# EAGLE design YOTSUBA_GNSSantenna_ver.1.0 (EAGLE 9.6.2)
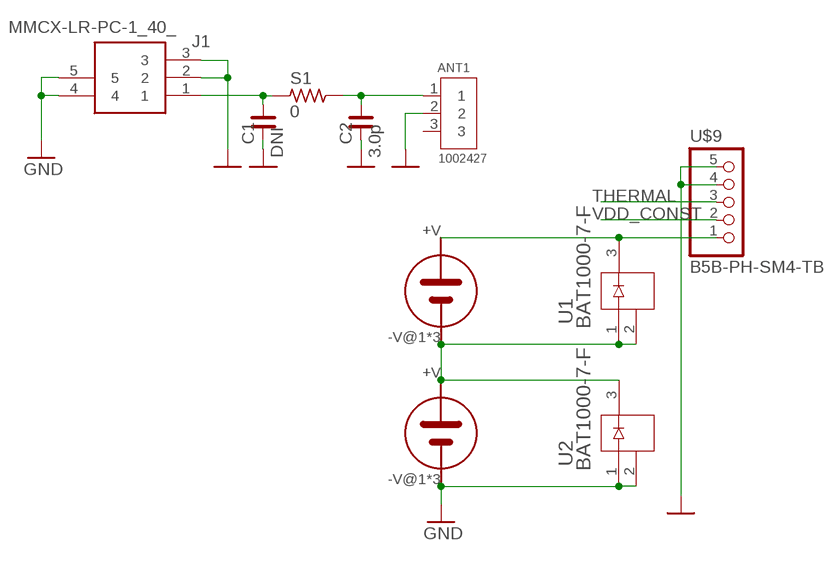
[diagram p0: schematic, sheet 1]

## Parts
ANT1  1002427  [ANTENNA_1002427]
C1  DNI  C_0603  [C0603]
C2  3.0p  C_0603  [C0603]
J1  MMCX-LR-PC-1_40_  [MMCXLRPC140]
S1  0  R_0603  [R0603]
U1  BAT1000-7-F  [SOT23_BAT_DIO]
U2  BAT1000-7-F  [SOT23_BAT_DIO]
U$2  3G30A  [SOLAR_3G30A]
U$3  3G30A  [SOLAR_3G30A]
U$9  B5B-PH-SM4-TB  [B5B-PH-SM4-TB]

## Nets
GND [GND]: ANT1.2 C1.1 C2.1 J1.2 J1.3 J1.4 J1.5 U2.1 U2.2 U$3.-V@1(-V) U$3.-V@2(-V) U$3.-V@3(-V) U$9.4 U$9.5
N$5: U1.1 U1.2 U2.3 U$2.-V@1(-V) U$2.-V@2(-V) U$2.-V@3(-V) U$3.+V
N$6: U1.3 U$2.+V U$9.1
RF1 [ANTENNA]: ANT1.1 C2.2 S1.2
RF2 [ANTENNA]: C1.2 J1.1 S1.1
THERMAL: U$9.3
VDD_CONST: U$9.2
Unconnected: ANT1.3

## Library data of the parts
ANT1 = 1002427:1002427: RF ANT 868MHZ/915MHZ STAMPED MET; DESCRIPTION: 868MHz, 915MHz, 1.575GHz Beidou, GLONASS, GPS, ISM, LoRa, LPWAN, Sigfox Stamped Metal RF Antenna 868MHz, 915MHz, 1.561GHz ~ 1.602GHz 3dBi Solder Surface Mount; DIGI-KEY_PART_NUMBER: 478-1002427TR-ND; MF: Ethertronics/AVX; MP: 1002427; PACKAGE: None; PURCHASE-URL: https://pricing.snapeda.com/search/part/1002427/?ref=eda
C1 C2 = rc-master_custom:C_: NON-POLARIZED CAP
J1 = MMCX-LR-PC-1_40_:MMCX-LR-PC-1_40_: RF Connectors / Coaxial Connectors MINI PUSH-ON CONN RECEPT RA Source: Datasheet <https://componentsearchengine.com/Datasheets/1/MMCX-LR-PC-1(40).pdf>; DESCRIPTION: RF Connectors / Coaxial Connectors MINI PUSH-ON CONN RECEPT RA; HEIGHT: 3.95mm; MANUFACTURER_NAME: Hirose; MANUFACTURER_PART_NUMBER: MMCX-LR-PC-1(40); MOUSER_PART_NUMBER: 798-MMCX-LR-PC-1(40); MOUSER_PRICE-STOCK: https://www.mouser.co.uk/ProductDetail/Hirose-Connector/MMCX-LR-PC-140?qs=XQjbzJWzFPVvtPijmLd%2FXQ%3D%3D
S1 = rc-master_custom:R_: RESISTOR
U1 U2 = BAT1000:BAT1000-7-F; COPYRIGHT: Copyright (C) 2022 Ultra Librarian. All rights reserved.; MANUFACTURER_PART_NUMBER: BAT1000-7-F; MFR_NAME: Diodes Inc
U$2 U$3 = 3G30A_normal:3G30A
U$9 = MITSUBA_Connectors-v4.0:B5B-PH-SM4-TB

## Net classes
2 GND: clearance 0.5 mm to class 0, clearance 0.1 mm to class 1, clearance 0.5 mm

## Board
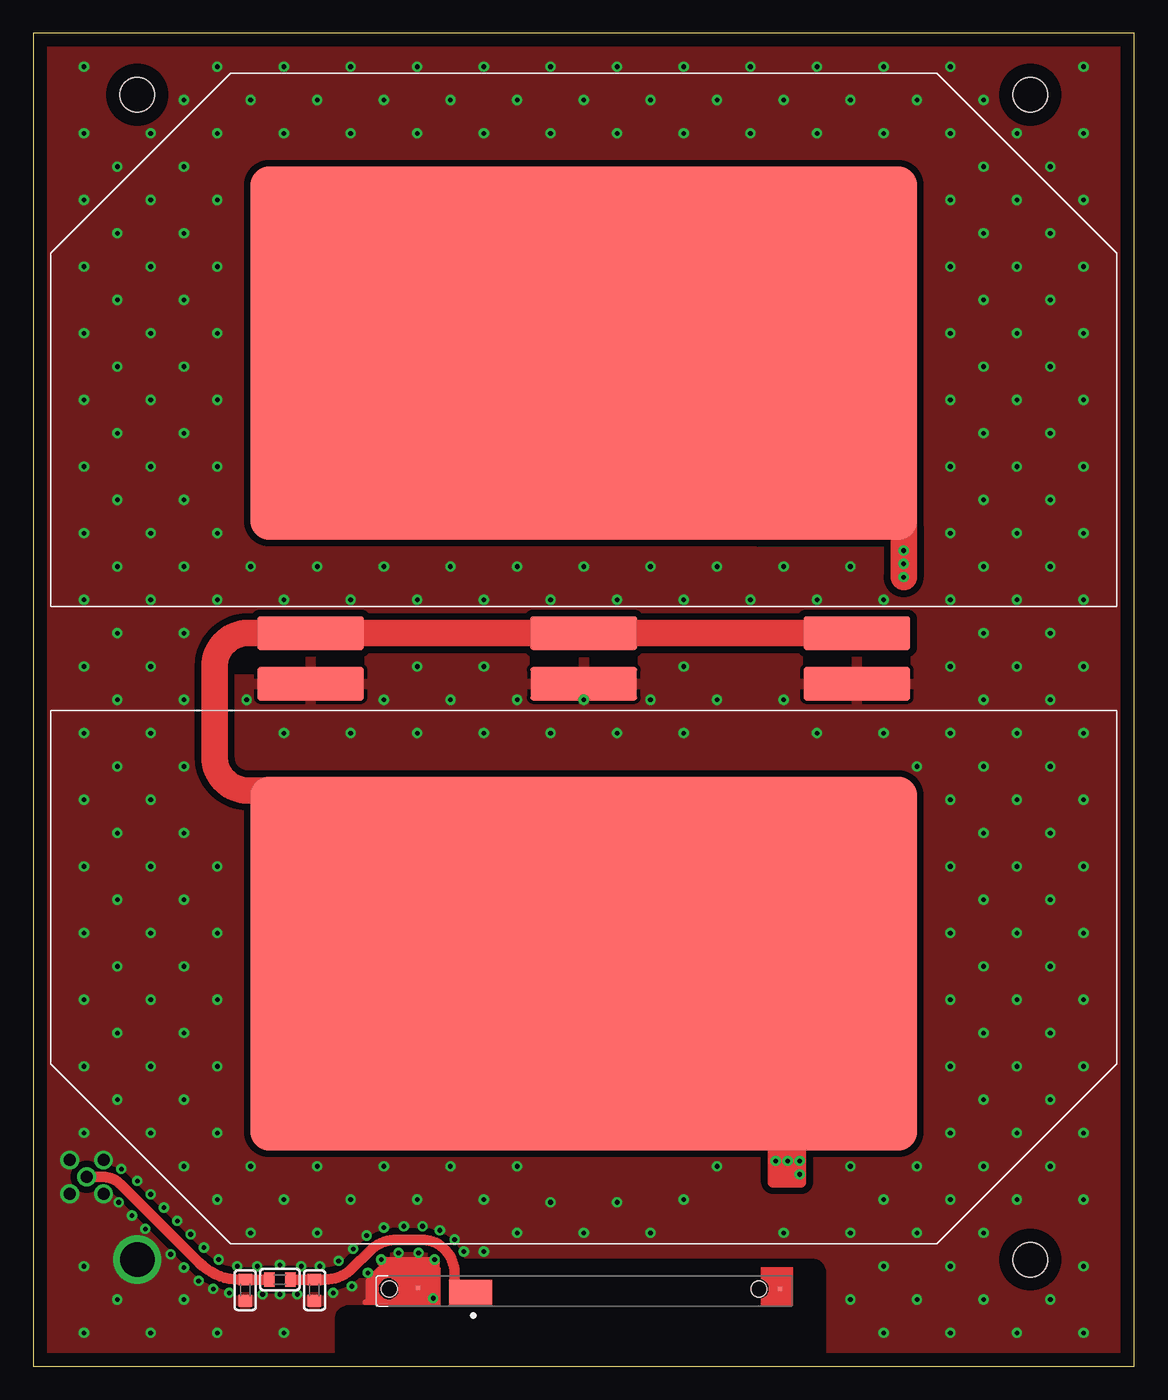
[diagram p1: board, top side]
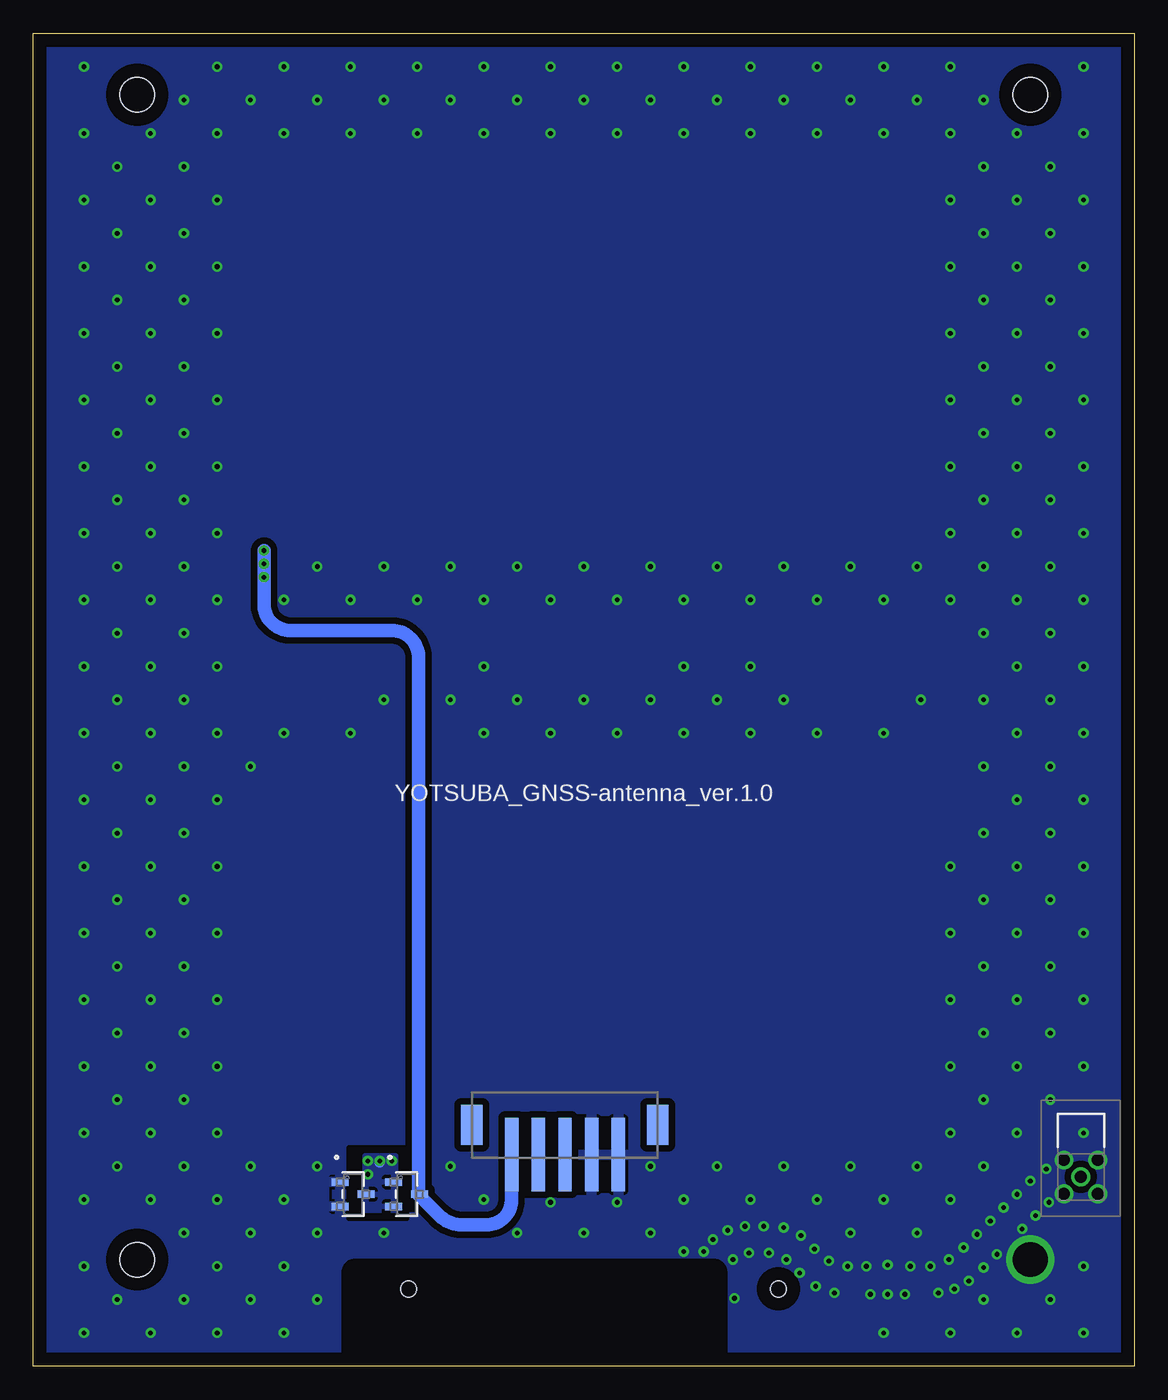
[diagram p2: board, bottom side, seen from below]

Size 82.6 x 100 mm. Coordinates in mm from the lower left corner, seen from the top.
Outline: 0,0 82.6,0 82.6,100 0,100 0,0
Copper layers (1*16): Top 0.035mm / dielectric 1.2mm / Bottom 0.035mm
Design rules "default *": minimum track width 6mil, minimum drill 0.35mm, track to track 6mil, track to pad 6mil, pad to pad 6mil, via to via 6mil, smd to smd 6mil, copper to edge 40mil, drill to drill 6mil, minimum pad ring 10mil, minimum via ring 8mil, stop-mask expansion 4mil, vias tented up to drill 30mil, thermal gap 10mil
Holes 2.6 mm at 74.8,8 7.8,95.4 74.8,95.4
tRestrict: 9 lines
bRestrict: 10 lines

### Footprints (pad centres in the part's own frame; a part is rotated, then mirrored left to right if it is on the bottom)
ANTENNA_1002427 = smd 3.2 x 1.9: 1 24.1,-1.05 | smd 0.3 x 0.3: 2 28.02,-1.375; 3 0.875,-1.325 | hole 1.2: 2.46,-1.3; 30.2,-1.3
C0603 = smd 0.9 x 1.1: 1 -0.794,0; 2 0.794,0
MMCXLRPC140 = drill 0.9 pad 1.4: 1 0,0; 2 -1.27,-1.27; 3 1.27,-1.27; 4 1.27,1.27; 5 -1.27,1.27
R0603 = smd 0.9 x 1.1: 1 -0.794,0; 2 0.794,0
SOT23_BAT_DIO = smd 0.559 x 1.27: 1 -0.915,-0.965; 2 0.915,-0.965; 3 0,0.965
SOLAR_3G30A = smd 50 x 28: +V 0,19 | smd 8 x 2.5: -V@1 -20.5,-2; -V@2 20.5,-2; -V@3 0,-2
B5B-PH-SM4-TB = smd 1 x 5.5: 1 0,0; 2 2,0; 3 4,0; 4 6,0; 5 8,0 | smd 1.6 x 3: MP1 -2.983,2.25; MP2 10.959,2.25

### Placement (x,y rotation side)
ANT1  56.9,4.5 180 top
C1  15.9,5.7 90 top
C2  21.1,5.7 90 top
J1  4,14.2 90 bottom
S1  18.5,6.5 0 top
U1  54.6,12.9 270 bottom
U2  58.6,12.9 270 bottom
U$2  41.3,57 0 top
U$3  41.3,49.2 180 top
U$9  46.71,15.87 0 bottom

### Tracks (layer width: path | path; a pad name or v marks a point on that pad's centre or on a via)
GND  (via drill 0.35, 2.6)
  Top 0.2: ANT1.2 29.34,4.8
  Top 0.4: 29.34,4.8 24.9,4.8 | 25.4,5.1 26,5.1
  Top 0.8: ANT1.2 30.1,5.88 30.1,7.8 26.9,7.8 | 26.9,7.8 26.2,7.8 | 26.9,7.8 26.9,7 26.1,7
  Top 1: 25.4,6.3 25.4,5.1
  Top 1.016: 26.1,7 25.4,6.3
  other vias: 16.8,7.5 18.5,7.6 20.1,7.5 21.5,7.5 17.2,5.4 18.5,5.4 19.8,5.4 22.9,7.9 24,8.8 25.1,7 23.9,6 26.1,8 25,9.8 22.5,5.5 26.3,10.4 27.8,10.5 27.4,8.5 28.9,8.5 29.2,10.5 30.5,10.2 31.6,9.5 32.3,8.6 30.1,8 33.8,8.6 41.3,50 36.3,50 43.8,47.5 33.8,47.5 31.3,50 33.8,52.5 28.8,52.5 26.3,50 28.8,47.5 23.8,47.5 18.8,47.5 16,50 38.8,47.5 46.3,50 51.3,50 48.8,52.5 48.8,47.5 56.3,50 58.8,47.5 63.8,47.5 66.3,45 68.8,47.5 71.3,45 73.8,47.5 71.3,50 68.8,52.5 73.8,52.5 78.8,52.5 76.3,50 78.8,47.5 76.3,45 78.8,42.5 73.8,42.5 68.8,42.5 71.3,40 68.8,37.5 73.8,37.5 76.3,40 78.8,37.5 76.3,35 71.3,35 73.8,32.5 78.8,32.5 76.3,30 71.3,30 68.8,32.5 68.8,27.5 73.8,27.5 78.8,27.5 76.3,25 71.3,25 68.8,22.5 73.8,22.5 78.8,22.5 76.3,20 71.3,20 68.8,17.5 73.8,17.5 78.8,17.5 71.3,15 66.3,15 76.3,15 78.8,12.5 78.8,7.5 73.8,12.5 68.8,12.5 63.8,12.5 61.3,15 61.3,10 66.3,10 71.3,10 68.8,7.5 63.8,7.5 61.3,5 63.8,2.5 66.3,5 71.3,5 68.8,2.5 73.8,2.5 76.3,5 78.8,2.5 56.3,10 46.3,10 41.3,10 43.8,12.3 38.8,12.3 36.3,10 33.8,12.5 36.3,15 31.3,15 26.3,15 28.8,12.5 23.8,12.5 18.8,12.5 21.3,15 16.3,15 13.8,12.5 21.3,10 16.3,10 48.8,12.5 51.3,15 13.8,17.5 8.8,17.5 11.3,20 6.3,20 8.8,22.5 13.8,22.5 11.3,25 6.3,25 3.8,22.5 8.8,27.5 13.8,27.5 11.3,30 6.3,30 3.8,27.5 3.8,32.5 8.8,32.5 13.8,32.5 11.3,35 6.3,35 8.8,37.5 13.8,37.5 11.3,40 6.3,40 3.8,37.5 3.8,42.5 8.8,42.5 6.3,45 3.8,47.5 8.8,47.5 11.3,45 6.3,50 11.3,50 8.8,52.5 3.8,52.5 6.3,55 3.8,57.5 8.8,57.5 11.3,55 13.8,57.5 11.3,60 6.3,60 3.8,62.5 8.8,62.5 13.8,62.5 16.3,60 21.3,60 18.8,57.5 23.8,57.5 26.3,60 28.8,57.5 31.3,60 33.8,57.5 36.3,60 38.8,57.5 41.3,60 46.3,60 43.8,57.5 48.8,57.5 51.3,60 53.8,57.5 56.3,60 58.8,57.5 61.3,60 63.8,57.5 68.8,57.5 71.3,55 73.8,57.5 71.3,60 76.3,55 78.8,57.5 76.3,60 78.8,62.5 73.8,62.5 68.8,62.5 71.3,65 76.3,65 78.8,67.5 73.8,67.5 68.8,67.5 71.3,70 76.3,70 78.8,72.5 73.8,72.5 71.3,75 68.8,72.5 76.3,75 73.8,77.5 68.8,77.5 71.3,80 76.3,80 78.8,77.5 6.3,65 3.8,67.5 8.8,67.5 11.3,65 13.8,67.5 11.3,70 6.3,70 3.8,72.5 8.8,72.5 13.8,72.5 11.3,75 6.3,75 8.8,77.5 3.8,77.5 6.3,80 3.8,82.5 13.8,77.5 11.3,80 8.8,82.5 13.8,82.5 11.3,85 6.3,85 3.8,87.5 8.8,87.5 13.8,87.5 11.3,90 6.3,90 3.8,92.5 3.8,97.5 8.8,92.5 13.8,92.5 11.3,95 13.8,97.5 16.3,95 18.8,97.5 18.8,92.5 21.3,95 23.8,97.5 26.3,95 23.8,92.5 28.8,92.5 28.8,97.5 31.3,95 33.8,92.5 33.8,97.5 36.3,95 38.8,97.5 38.8,92.5 41.3,95 43.8,97.5 43.8,92.5 46.3,95 48.8,97.5 48.8,92.5 56.3,95 51.3,95 53.8,97.5 53.8,92.5 58.8,97.5 61.3,95 58.8,92.5 63.8,92.5 66.3,95 63.8,97.5 68.8,97.5 71.3,95 68.8,92.5 73.8,92.5 71.3,90 68.8,87.5 68.8,82.5 71.3,85 73.8,82.5 76.3,85 73.8,87.5 76.3,90 78.8,87.5 78.8,82.5 78.8,92.5 78.8,97.5 18.8,2.5 13.8,2.5 8.8,2.5 11.3,5 6.3,5 3.8,2.5 3.8,7.5 30,5.1 11.3,15 7.8,8 6.6,14.8 3.8,17.5 7.8,13.9 8.8,12.9 9.8,11.9 10.8,10.9 11.8,9.9 12.8,8.9 13.9,8 6.4,12.3 7.4,11.3 8.4,10.3 10.3,8.4 11.3,7.4 12.4,6.4 13.5,5.8 15.3,7.5 14.7,5.5
  pour Top: 2.7,103.9 -4.35,103.9 arc90 -4.6,103.65 -4.6,86.5 -4.6,-4.85 arc90 -4.35,-5.1 88.9,-5.1 88.9,103.65 arc90 88.65,103.9
  pour Bottom: -4.9,-0.9 -4.9,104.4 arc-90 -3.9,105.4 10.4,105.4 86.3,105.4 arc-90 87.3,104.4 87.3,86.3 87.3,-4.3 arc-90 86.3,-5.3 65.1,-5.3 -3.9,-5.3 arc-90 -4.9,-4.3
N$5  (via drill 0.35)
  Top 0.8: U$3.+V 57.6,30.2 57.6,13.8 55.5,13.8 55.5,15.7 | 55.5,15.7 55.5,16.3 57.2,16.3 57.2,15.7 v57.5,15.4 57.2,15.1 | 56.6,14.4 56,14.4 56,15.3 56.6,15.3 | v56.6,15.4 56.6,14.4 | v56.6,15.4 56.6,15.7 55.5,15.7 | v56.6,15.4 56.9,15.1 57.2,15.1 | 57.2,15.1 57.2,14.7 v57.5,14.4 56.6,14.4
  Top 2: U$2.-V@3 41.6,54.7 41.8,54.9 | 41.8,54.9 41.5,54.9 U$2.-V@3 | U$3.+V 21.6,30.2 21.6,43.2 16.1,43.2 arc-90 13.6,45.7 13.6,52.5 arc-90 16.1,55 U$2.-V@1 41.8,55 41.8,54.9 | U$2.-V@3 U$2.-V@2 | U$2.-V@2 62.8,55 | 62.8,55.1 61.8,55.1 U$2.-V@2
  Bottom 0.8: v56.6,15.4 56.6,15.3
  other vias: 55.7,15.4
  pour Bottom: 55.4,15.8 57.7,15.8 57.7,11.7 55.4,11.7
N$6  (via drill 0.35)
  Top 2: U$2.+V 41.59,76 54.3,63 65.3,63 v65.3,59.2
  Bottom 1: v65.3,61.2 v65.3,60.2 v65.3,59.2 65.3,57.2 arc-90 63.3,55.2 55.7,55.2 arc90 53.7,53.2 53.7,12.9 U1.3 53.63,12.8 52.15,11.31 arc-45 50.43,10.6 48.61,10.6 arc-90 46.71,12.5 U$9.1
RF1
  Top 0.8: ANT1.1 31.6,5.55 31.6,7 arc90 29.1,9.5 27.34,9.5 arc45 25.22,8.62 23.97,7.37 arc-45 21.85,6.49 C2.2 S1.2
RF2
  Top 0.8: S1.1 C1.2 15.47,6.49 arc-45 12.46,7.74 6.59,13.61 arc45 5.17,14.2 J1.1
(copper drawn outside any net)
  shapes: Top circle x1

### Text on the board
bNames: YOTSUBA_GNSS-antenna_ver.1.0